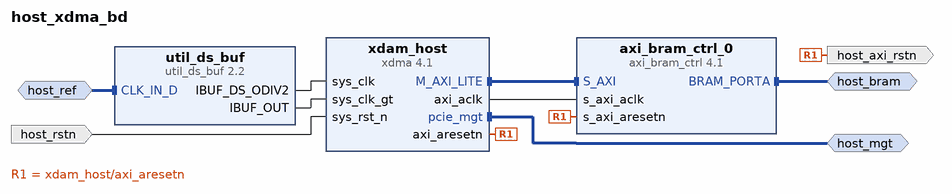
[diagram p0: block diagram of the top level]
# Vivado block design host_xdma_bd, xczu19eg-ffvd1760-2-e, Vivado 2021.2
create_bd_design host_xdma_bd

create_bd_intf_port -mode Master -vlnv xilinx.com:interface:pcie_7x_mgt_rtl:1.0 host_mgt
create_bd_intf_port -mode Slave -vlnv xilinx.com:interface:diff_clock_rtl:1.0 host_ref
set_property -dict {CONFIG.FREQ_HZ 100000000} [get_bd_intf_ports host_ref]
create_bd_intf_port -mode Master -vlnv xilinx.com:interface:bram_rtl:1.0 host_bram
set_property -dict {CONFIG.MASTER_TYPE BRAM_CTRL CONFIG.READ_WRITE_MODE READ_WRITE} [get_bd_intf_ports host_bram]
create_bd_port -dir I -type rst host_rstn
set_property -dict {CONFIG.POLARITY ACTIVE_LOW} [get_bd_ports host_rstn]
create_bd_port -dir O -type rst host_axi_rstn

create_bd_cell -type ip -vlnv xilinx.com:ip:xdma:4.1 xdam_host
set_property -dict [list \
  CONFIG.axi_data_width 512_bit \
  CONFIG.axilite_master_en true \
  CONFIG.axisten_freq 250 \
  CONFIG.pl_link_cap_max_link_speed 8.0_GT/s \
  CONFIG.pl_link_cap_max_link_width X16 \
  CONFIG.xdma_axi_intf_mm AXI_Memory_Mapped \
  CONFIG.xdma_rnum_chnl 4 \
  CONFIG.xdma_wnum_chnl 4 \
] [get_bd_cells xdam_host]
create_bd_cell -type ip -vlnv xilinx.com:ip:util_ds_buf:2.2 util_ds_buf
set_property -dict {CONFIG.C_BUF_TYPE IBUFDSGTE} [get_bd_cells util_ds_buf]
create_bd_cell -type ip -vlnv xilinx.com:ip:axi_bram_ctrl:4.1 axi_bram_ctrl_0
set_property -dict {CONFIG.PROTOCOL AXI4LITE CONFIG.SINGLE_PORT_BRAM 1} [get_bd_cells axi_bram_ctrl_0]

# ---- connections ----

connect_bd_intf_net [get_bd_intf_ports host_bram] [get_bd_intf_pins axi_bram_ctrl_0/BRAM_PORTA]
connect_bd_intf_net -intf_net diff_clock_rtl_0_1 [get_bd_intf_ports host_ref] [get_bd_intf_pins util_ds_buf/CLK_IN_D]
connect_bd_intf_net [get_bd_intf_pins axi_bram_ctrl_0/S_AXI] [get_bd_intf_pins xdam_host/M_AXI_LITE]
connect_bd_intf_net [get_bd_intf_ports host_mgt] [get_bd_intf_pins xdam_host/pcie_mgt]
connect_bd_net -net reset_rtl_0_1 [get_bd_ports host_rstn] [get_bd_pins xdam_host/sys_rst_n]
connect_bd_net [get_bd_pins util_ds_buf/IBUF_DS_ODIV2] [get_bd_pins xdam_host/sys_clk]
connect_bd_net [get_bd_pins util_ds_buf/IBUF_OUT] [get_bd_pins xdam_host/sys_clk_gt]
connect_bd_net [get_bd_pins xdam_host/axi_aclk] [get_bd_pins axi_bram_ctrl_0/s_axi_aclk]
connect_bd_net [get_bd_pins xdam_host/axi_aresetn] [get_bd_pins axi_bram_ctrl_0/s_axi_aresetn] [get_bd_ports host_axi_rstn]

# ---- address map ----
assign_bd_address -offset 0x00000000 -range 1M -target_address_space [get_bd_addr_spaces xdam_host/M_AXI_LITE] [get_bd_addr_segs axi_bram_ctrl_0/S_AXI/Mem0]

validate_bd_design
save_bd_design
